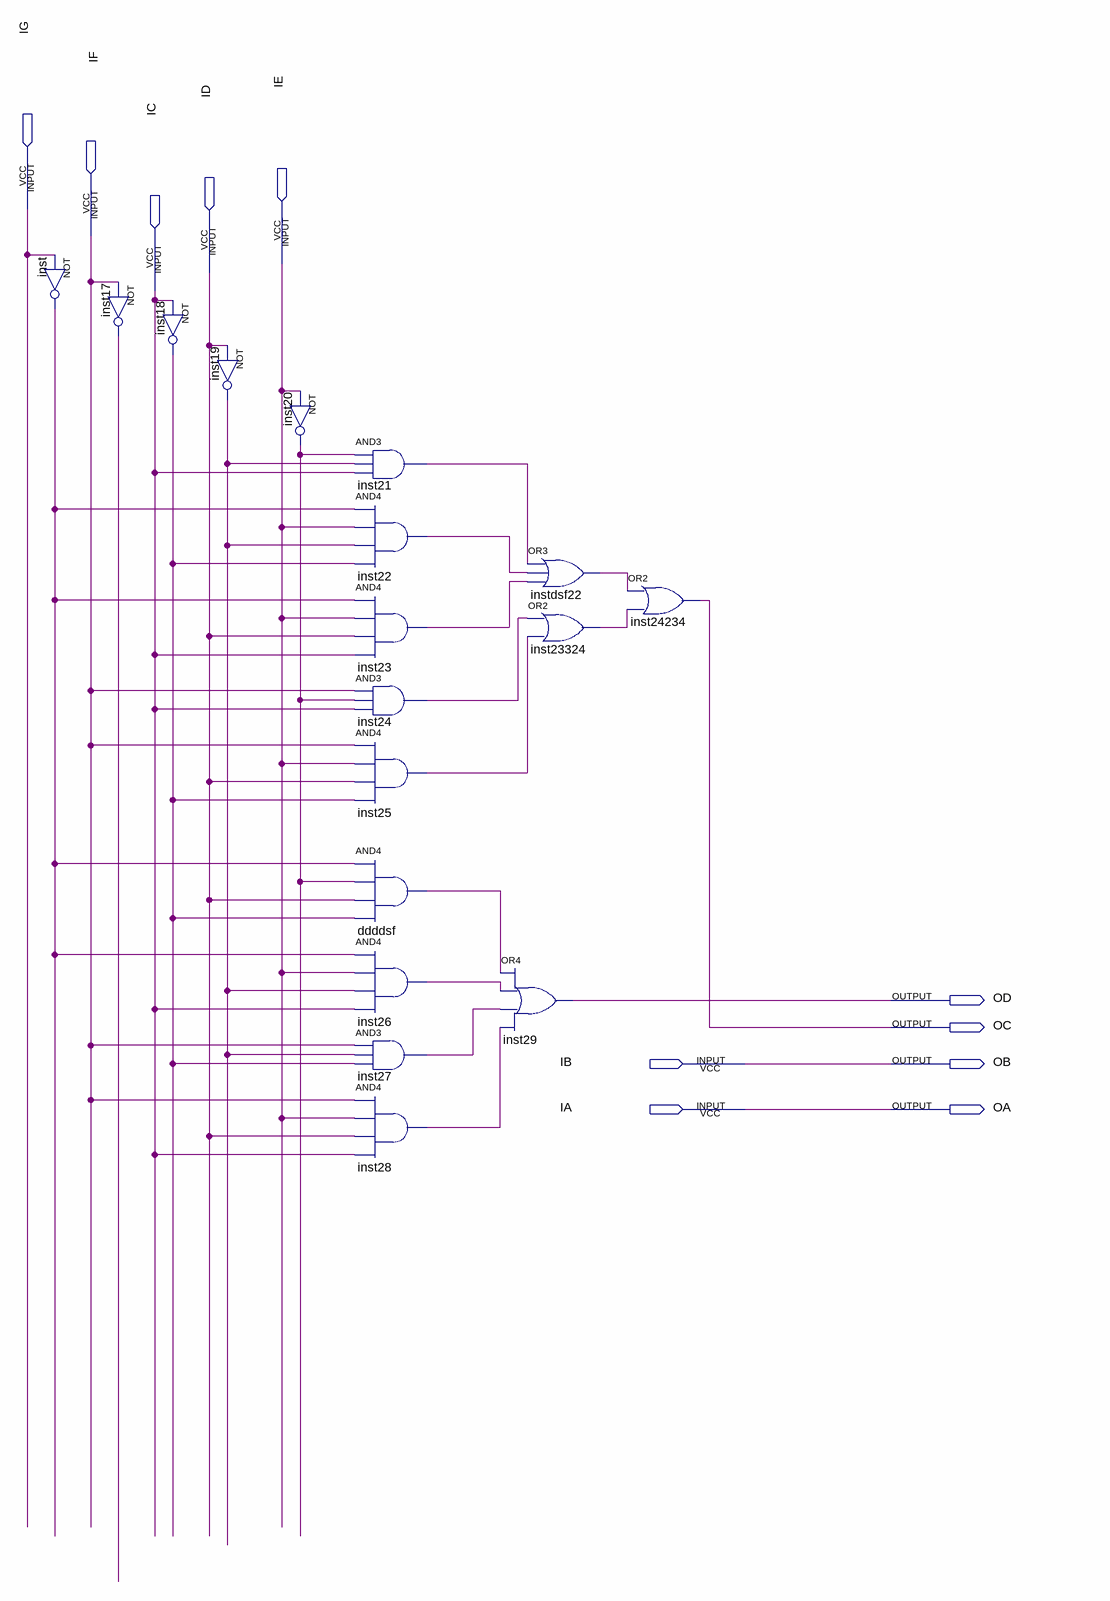
[diagram p0: schematic sheet]
// Quartus schematic remainder_12.bdf as structural Verilog: 18 symbols, 11 pins
module remainder_12 (
  input  IG,
  input  IF,
  input  IE,
  input  ID,
  input  IC,
  input  IB,
  input  IA,
  output OD,
  output OC,
  output OB,
  output OA
);

  wire ddddsf_out, inst17_out, inst18_out, inst19_out, inst20_out, inst21_out, inst22_out, inst23_out,
       inst24_out, inst25_out, inst26_out, inst27_out, inst28_out, inst23324_out, inst_out, instdsf22_out;

  not inst (inst_out, IG);
  not inst17 (inst17_out, IF);
  not inst18 (inst18_out, IC);
  not inst19 (inst19_out, ID);
  not inst20 (inst20_out, IE);
  and inst21 (inst21_out, inst20_out, inst19_out, IC);
  and inst22 (inst22_out, inst_out, IE, inst19_out, inst18_out);
  and inst23 (inst23_out, inst_out, IE, ID, IC);
  and inst24 (inst24_out, IF, inst20_out, IC);
  and inst25 (inst25_out, IF, IE, ID, inst18_out);
  and ddddsf (ddddsf_out, inst_out, inst20_out, ID, inst18_out);
  and inst26 (inst26_out, inst_out, IE, inst19_out, IC);
  and inst27 (inst27_out, IF, inst19_out, inst18_out);
  and inst28 (inst28_out, IF, IE, ID, IC);
  or instdsf22 (instdsf22_out, inst21_out, inst22_out, inst23_out);
  or inst23324 (inst23324_out, inst24_out, inst25_out);
  or inst29 (OD, ddddsf_out, inst26_out, inst27_out, inst28_out);
  or inst24234 (OC, instdsf22_out, inst23324_out);

  assign OA = IA;
  assign OB = IB;
endmodule
